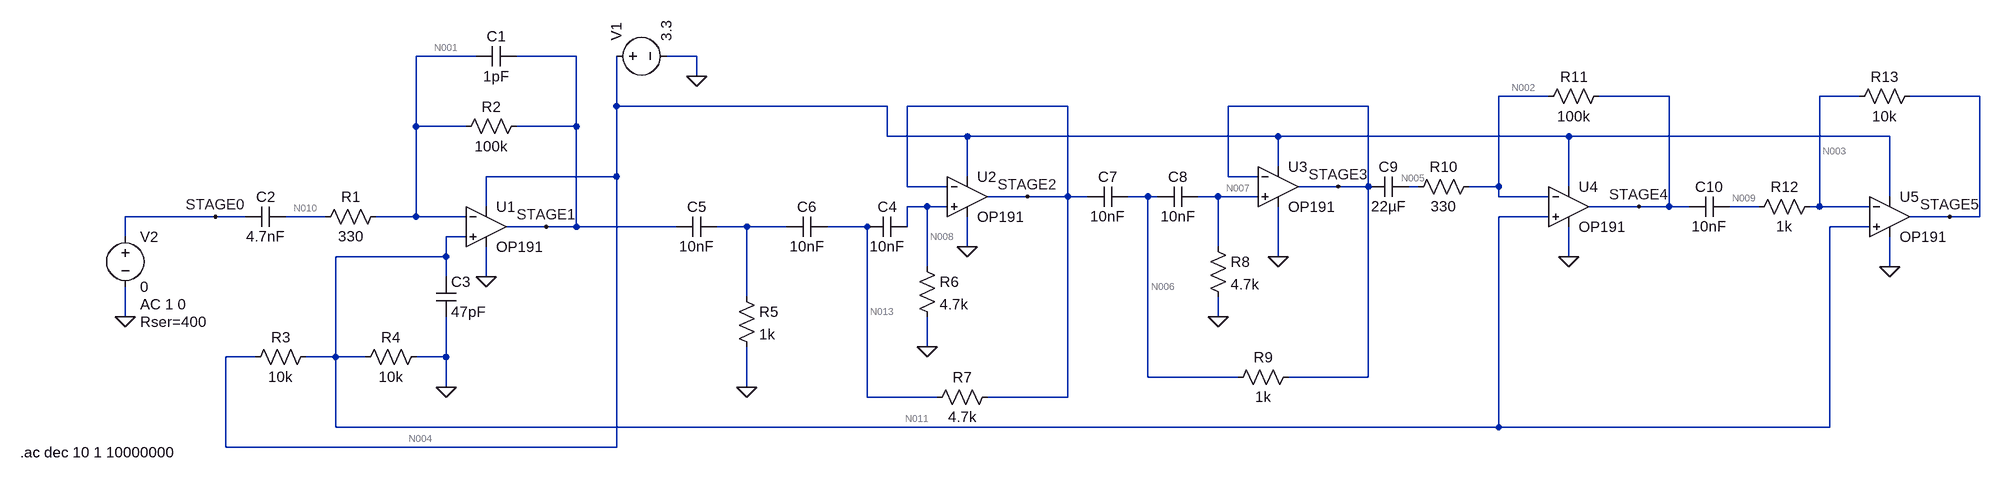
[diagram p0: schematic mic_sim_butterworth_2ndorder.asc]
mic_sim_butterworth_2ndorder.asc, the LTspice schematic file:
Version 4
SHEET 1 3312 680
WIRE 848 -16 752 -16
WIRE 1008 -16 912 -16
WIRE 1200 -16 1152 -16
WIRE 1200 16 1200 -16
WIRE 2560 48 2480 48
WIRE 2752 48 2640 48
WIRE 3056 48 2992 48
WIRE 3248 48 3136 48
WIRE 1072 64 1072 -16
WIRE 1504 64 1072 64
WIRE 1792 64 1536 64
WIRE 2272 64 2048 64
WIRE 752 96 752 -16
WIRE 832 96 752 96
WIRE 1008 96 1008 -16
WIRE 1008 96 912 96
WIRE 1504 112 1504 64
WIRE 1632 112 1504 112
WIRE 2128 112 1632 112
WIRE 2592 112 2128 112
WIRE 3104 112 2592 112
WIRE 2128 160 2128 112
WIRE 1072 176 1072 64
WIRE 1072 176 864 176
WIRE 1632 176 1632 112
WIRE 2048 176 2048 64
WIRE 2096 176 2048 176
WIRE 1536 192 1536 64
WIRE 1600 192 1536 192
WIRE 2224 192 2160 192
WIRE 2272 192 2272 64
WIRE 2272 192 2224 192
WIRE 2352 192 2336 192
WIRE 2480 192 2480 48
WIRE 2480 192 2432 192
WIRE 2592 192 2592 112
WIRE 1728 208 1664 208
WIRE 1792 208 1792 64
WIRE 1792 208 1728 208
WIRE 1824 208 1792 208
WIRE 1920 208 1888 208
WIRE 1936 208 1920 208
WIRE 2032 208 2000 208
WIRE 2096 208 2032 208
WIRE 2480 208 2480 192
WIRE 2560 208 2480 208
WIRE 3104 208 3104 112
WIRE 864 224 864 176
WIRE 1568 224 1536 224
WIRE 1600 224 1568 224
WIRE 2704 224 2624 224
WIRE 2752 224 2752 48
WIRE 2752 224 2704 224
WIRE 2784 224 2752 224
WIRE 2896 224 2848 224
WIRE 2992 224 2992 48
WIRE 2992 224 2976 224
WIRE 3072 224 2992 224
WIRE 432 240 288 240
WIRE 480 240 432 240
WIRE 608 240 544 240
WIRE 752 240 752 96
WIRE 752 240 688 240
WIRE 832 240 752 240
WIRE 2560 240 2480 240
WIRE 3200 240 3136 240
WIRE 3248 240 3248 48
WIRE 3248 240 3200 240
WIRE 960 256 896 256
WIRE 1008 256 1008 96
WIRE 1008 256 960 256
WIRE 1168 256 1008 256
WIRE 1280 256 1232 256
WIRE 1344 256 1280 256
WIRE 1472 256 1408 256
WIRE 1536 256 1536 224
WIRE 3072 256 3008 256
WIRE 288 272 288 240
WIRE 832 272 800 272
WIRE 1632 288 1632 240
WIRE 2032 288 2032 208
WIRE 800 304 800 272
WIRE 800 304 624 304
WIRE 2128 304 2128 224
WIRE 2592 304 2592 256
WIRE 1568 320 1568 224
WIRE 3104 320 3104 272
WIRE 800 336 800 304
WIRE 864 336 864 288
WIRE 1280 368 1280 256
WIRE 288 400 288 352
WIRE 2032 400 2032 368
WIRE 1568 448 1568 400
WIRE 496 464 448 464
WIRE 624 464 624 304
WIRE 624 464 576 464
WIRE 672 464 624 464
WIRE 800 464 800 400
WIRE 800 464 752 464
WIRE 1920 496 1920 208
WIRE 2064 496 1920 496
WIRE 2272 496 2272 192
WIRE 2272 496 2144 496
WIRE 800 512 800 464
WIRE 1280 512 1280 448
WIRE 1472 528 1472 256
WIRE 1584 528 1472 528
WIRE 1792 528 1792 208
WIRE 1792 528 1664 528
WIRE 624 576 624 464
WIRE 2480 576 2480 240
WIRE 2480 576 624 576
WIRE 3008 576 3008 256
WIRE 3008 576 2480 576
WIRE 448 608 448 464
WIRE 1072 608 1072 176
WIRE 1072 608 448 608
FLAG 800 512 0
FLAG 864 336 0
FLAG 1200 16 0
FLAG 288 400 0
FLAG 1568 448 0
FLAG 1632 288 0
FLAG 1280 512 0
FLAG 2128 304 0
FLAG 960 256 STAGE1
FLAG 1728 208 STAGE2
FLAG 2224 192 STAGE3
FLAG 2032 400 0
FLAG 2592 304 0
FLAG 2704 224 STAGE4
FLAG 3104 320 0
FLAG 3200 240 STAGE5
FLAG 432 240 STAGE0
SYMBOL res 704 224 R90
WINDOW 0 0 56 VBottom 2
WINDOW 3 32 56 VTop 2
SYMATTR InstName R1
SYMATTR Value 330
SYMBOL res 928 80 R90
WINDOW 0 0 56 VBottom 2
WINDOW 3 32 56 VTop 2
SYMATTR InstName R2
SYMATTR Value 100k
SYMBOL res 592 448 R90
WINDOW 0 0 56 VBottom 2
WINDOW 3 32 56 VTop 2
SYMATTR InstName R3
SYMATTR Value 10k
SYMBOL res 768 448 R90
WINDOW 0 0 56 VBottom 2
WINDOW 3 32 56 VTop 2
SYMATTR InstName R4
SYMATTR Value 10k
SYMBOL cap 544 224 R90
WINDOW 0 0 32 VBottom 2
WINDOW 3 32 32 VTop 2
SYMATTR InstName C2
SYMATTR Value 4.7nF
SYMBOL cap 784 336 R0
SYMATTR InstName C3
SYMATTR Value 47pF
SYMBOL OpAmps\\OP191 864 192 R0
SYMATTR InstName U1
SYMBOL voltage 1056 -16 R270
WINDOW 123 0 0 Left 0
WINDOW 39 0 0 Left 0
SYMATTR InstName V1
SYMATTR Value 3.3
SYMBOL voltage 288 256 R0
WINDOW 123 24 124 Left 2
WINDOW 39 24 152 Left 2
SYMATTR Value2 AC 1 0
SYMATTR SpiceLine Rser=400
SYMATTR InstName V2
SYMATTR Value 0
SYMBOL cap 912 -32 R90
WINDOW 0 0 32 VBottom 2
WINDOW 3 32 32 VTop 2
SYMATTR InstName C1
SYMATTR Value 1pF
SYMBOL OpAmps\\OP191 1632 144 R0
SYMATTR InstName U2
SYMBOL cap 1536 240 R90
WINDOW 0 0 32 VBottom 2
WINDOW 3 32 32 VTop 2
SYMATTR InstName C4
SYMATTR Value 10nF
SYMBOL cap 1232 240 R90
WINDOW 0 0 32 VBottom 2
WINDOW 3 32 32 VTop 2
SYMATTR InstName C5
SYMATTR Value 10nF
SYMBOL res 1264 352 R0
SYMATTR InstName R5
SYMATTR Value 1k
SYMBOL res 1552 304 R0
SYMATTR InstName R6
SYMATTR Value 4.7k
SYMBOL res 1680 512 R90
WINDOW 0 0 56 VBottom 2
WINDOW 3 32 56 VTop 2
SYMATTR InstName R7
SYMATTR Value 4.7k
SYMBOL cap 1408 240 R90
WINDOW 0 0 32 VBottom 2
WINDOW 3 32 32 VTop 2
SYMATTR InstName C6
SYMATTR Value 10nF
SYMBOL OpAmps\\OP191 2128 128 R0
SYMATTR InstName U3
SYMBOL cap 1888 192 R90
WINDOW 0 0 32 VBottom 2
WINDOW 3 32 32 VTop 2
SYMATTR InstName C7
SYMATTR Value 10nF
SYMBOL cap 2000 192 R90
WINDOW 0 0 32 VBottom 2
WINDOW 3 32 32 VTop 2
SYMATTR InstName C8
SYMATTR Value 10nF
SYMBOL res 2016 272 R0
SYMATTR InstName R8
SYMATTR Value 4.7k
SYMBOL res 2048 512 R270
WINDOW 0 32 56 VTop 2
WINDOW 3 0 56 VBottom 2
SYMATTR InstName R9
SYMATTR Value 1k
SYMBOL OpAmps\\OP191 2592 160 R0
SYMATTR InstName U4
SYMBOL res 2448 176 R90
WINDOW 0 0 56 VBottom 2
WINDOW 3 32 56 VTop 2
SYMATTR InstName R10
SYMATTR Value 330
SYMBOL res 2656 32 R90
WINDOW 0 0 56 VBottom 2
WINDOW 3 32 56 VTop 2
SYMATTR InstName R11
SYMATTR Value 100k
SYMBOL cap 2336 176 R90
WINDOW 0 0 32 VBottom 2
WINDOW 3 32 32 VTop 2
SYMATTR InstName C9
SYMATTR Value 22µF
SYMBOL OpAmps\\OP191 3104 176 R0
SYMATTR InstName U5
SYMBOL res 2992 208 R90
WINDOW 0 0 56 VBottom 2
WINDOW 3 32 56 VTop 2
SYMATTR InstName R12
SYMATTR Value 1k
SYMBOL res 3152 32 R90
WINDOW 0 0 56 VBottom 2
WINDOW 3 32 56 VTop 2
SYMATTR InstName R13
SYMATTR Value 10k
SYMBOL cap 2848 208 R90
WINDOW 0 0 32 VBottom 2
WINDOW 3 32 32 VTop 2
SYMATTR InstName C10
SYMATTR Value 10nF
TEXT 120 616 Left 2 !.ac dec 10 1 10000000

The netlist it stands for:
* mic_sim_butterworth_2ndorder.asc
R1 N001 N010 330
R2 STAGE1 N001 100k
R3 N011 N004 10k
R4 0 N011 10k
C2 N010 STAGE0 4.7nF
C3 N011 0 47pF
XU1 N011 N001 N004 0 STAGE1 OP191  ; pins In+ In- V+ V- OUT
V1 N004 0 3.3
V2 STAGE0 0 0 AC 1 0 Rser=400
C1 STAGE1 N001 1pF
XU2 N008 STAGE2 N004 0 STAGE2 OP191  ; pins In+ In- V+ V- OUT
C4 N008 N013 10nF
C5 N012 STAGE1 10nF
R5 N012 0 1k
R6 N008 0 4.7k
R7 STAGE2 N013 4.7k
C6 N013 N012 10nF
XU3 N007 STAGE3 N004 0 STAGE3 OP191  ; pins In+ In- V+ V- OUT
C7 N006 STAGE2 10nF
C8 N007 N006 10nF
R8 N007 0 4.7k
R9 N006 STAGE3 1k
XU4 N011 N002 N004 0 STAGE4 OP191  ; pins In+ In- V+ V- OUT
R10 N002 N005 330
R11 STAGE4 N002 100k
C9 N005 STAGE3 22µF
XU5 N011 N003 N004 0 STAGE5 OP191  ; pins In+ In- V+ V- OUT
R12 N003 N009 1k
R13 STAGE5 N003 10k
C10 N009 STAGE4 10nF
.ac dec 10 1 10000000
.lib ADI.lib
.backanno
.end

* Results of the author's LTspice run, read from the files saved beside the schematic
* Operating Point, zero values left out:
*   V(n001) = 1.65 V
*   V(n010) = 1.65 V
*   V(stage1) = 1.647 V
*   V(n011) = 1.65 V
*   V(n004) = 3.3 V
*   V(stage2) = 50.76 mV
*   V(n008) = 246.6 µV
*   V(n013) = 50.76 mV
*   V(stage3) = 50.76 mV
*   V(n007) = 246.6 µV
*   V(n006) = 50.76 mV
*   V(n002) = 1.65 V
*   V(stage4) = 1.647 V
*   V(n005) = 1.65 V
*   V(n003) = 1.65 V
*   V(stage5) = 1.65 V
*   V(n009) = 1.65 V
*   I(R13) = -30.05 nA
*   I(R11) = -30.05 nA
*   I(R8) = 52.48 nA
*   I(R6) = 52.48 nA
*   I(R4) = -165 µA
*   I(R3) = -165 µA
*   I(R2) = -30.05 nA
*   I(V1) = -1.315 mA
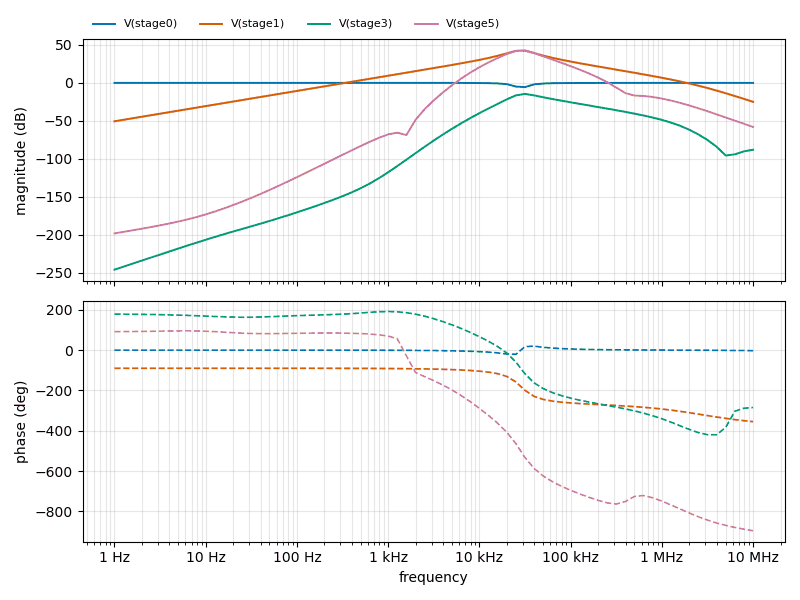
[diagram p1: AC Analysis of mic_sim_butterworth_2ndorder.asc, plotted from the saved traces]
* AC Analysis, 1 run:
*   V(stage0): -0.00 dB at 1 Hz, -0.06 dB at 10 MHz, peak -0.00 dB at 1 Hz, 3 dB below the peak at 22 kHz
*   V(stage1): -50.59 dB at 1 Hz, -24.93 dB at 10 MHz, peak 42.33 dB at 31.62 kHz, 3 dB below the peak at 20.65 kHz and 39.63 kHz
*   V(stage3): -245.89 dB at 1 Hz, -87.96 dB at 10 MHz, peak -14.51 dB at 31.62 kHz, 3 dB below the peak at 23.95 kHz and 44.14 kHz
*   V(stage5): -198.16 dB at 1 Hz, -58.00 dB at 10 MHz, peak 42.74 dB at 31.62 kHz, 3 dB below the peak at 22.03 kHz and 38.63 kHz